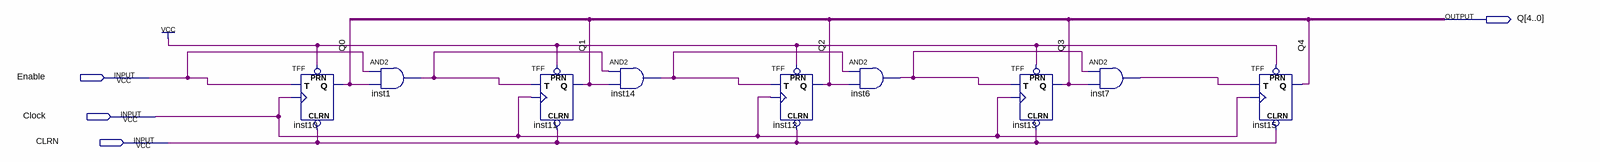
[diagram p0: schematic sheet]
// Quartus schematic lab10step2b.bdf as structural Verilog: 9 symbols, 4 pins
module lab10step2b (
  input  Enable,
  input  Clock,
  input  CLRN,
  output [4:0] Q
);

  wire inst1_out, inst6_out, inst7_out, inst14_out;

  TFF inst10 (.PRN(1'b1), .CLRN(CLRN), .T(Enable), .CLK(Clock), .Q(Q[0]));
  and inst1 (inst1_out, Enable, Q[0]);
  TFF inst11 (.PRN(1'b1), .CLRN(CLRN), .T(inst1_out), .CLK(Clock), .Q(Q[1]));
  and inst14 (inst14_out, inst1_out, Q[1]);
  TFF inst12 (.PRN(1'b1), .CLRN(CLRN), .T(inst14_out), .CLK(Clock), .Q(Q[2]));
  and inst6 (inst6_out, inst14_out, Q[2]);
  TFF inst13 (.PRN(1'b1), .CLRN(CLRN), .T(inst6_out), .CLK(Clock), .Q(Q[3]));
  and inst7 (inst7_out, inst6_out, Q[3]);
  TFF inst15 (.PRN(1'b1), .CLRN(CLRN), .T(inst7_out), .CLK(Clock), .Q(Q[4]));
endmodule
